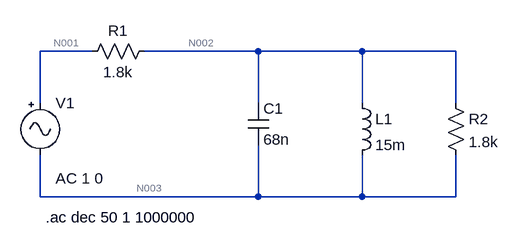
[diagram p0: schematic P5d.asc]
P5d.asc, the LTspice schematic file:
Version 4.1
SHEET 1 880 680
WIRE 192 64 112 64
WIRE 448 64 272 64
WIRE 608 64 448 64
WIRE 752 64 608 64
WIRE 112 144 112 64
WIRE 448 144 448 64
WIRE 608 144 608 64
WIRE 752 144 752 64
WIRE 112 288 112 224
WIRE 448 288 448 208
WIRE 448 288 112 288
WIRE 608 288 608 224
WIRE 608 288 448 288
WIRE 752 288 752 224
WIRE 752 288 608 288
SYMBOL Misc\\signal 112 128 R0
WINDOW 123 24 132 Left 2
WINDOW 39 0 0 Left 0
SYMATTR InstName V1
SYMATTR Value ""
SYMATTR Value2 AC 1 0
SYMBOL res 288 48 R90
WINDOW 0 0 56 VBottom 2
WINDOW 3 32 56 VTop 2
SYMATTR InstName R1
SYMATTR Value 1.8k
SYMBOL cap 432 144 R0
SYMATTR InstName C1
SYMATTR Value 68n
SYMBOL ind 592 128 R0
SYMATTR InstName L1
SYMATTR Value 15m
SYMATTR SpiceLine Rser=1m
SYMBOL res 736 128 R0
SYMATTR InstName R2
SYMATTR Value 1.8k
TEXT 120 320 Left 2 !.ac dec 50 1 1000000

The netlist it stands for:
* P5d.asc
V1 N001 N003 AC 1 0
R1 N002 N001 1.8k
C1 N002 N003 68n
L1 N002 N003 15m Rser=1m
R2 N002 N003 1.8k
.ac dec 50 1 1000000
.backanno
.end

* Results of the author's LTspice run, read from the files saved beside the schematic
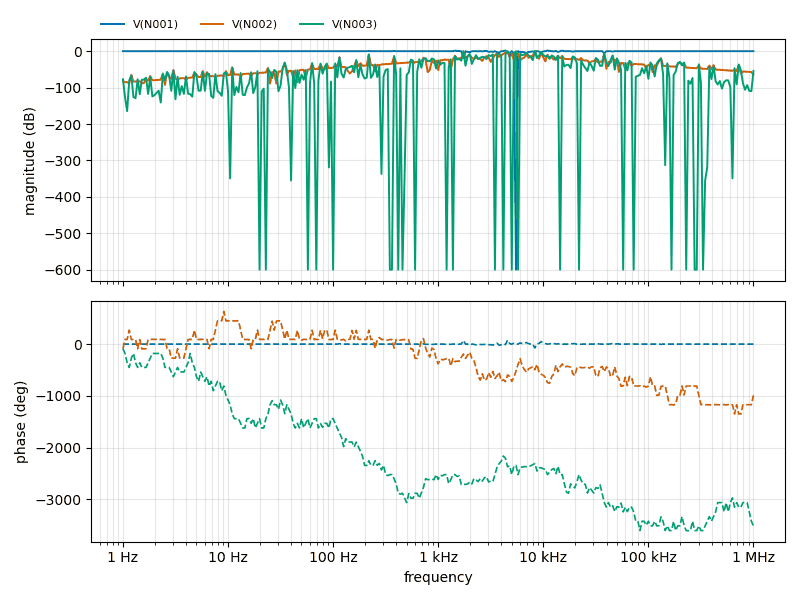
[diagram p1: AC Analysis of P5d.asc, plotted from the saved traces]
* AC Analysis, 1 run:
*   V(N001): 0.00 dB at 1 Hz, 0.00 dB at 1 MHz, peak 2.11 dB at 4.365 kHz, 3 dB below the peak at 3.942 kHz and 4.438 kHz
*   V(N002): -81.33 dB at 1 Hz, -64.28 dB at 1 MHz, peak 0.75 dB at 8.318 kHz, 3 dB below the peak at 8.233 kHz and 8.384 kHz
*   V(N003): -77.19 dB at 1 Hz, -54.38 dB at 1 MHz, peak 0.31 dB at 8.318 kHz, 3 dB below the peak at 8.271 kHz and 8.379 kHz